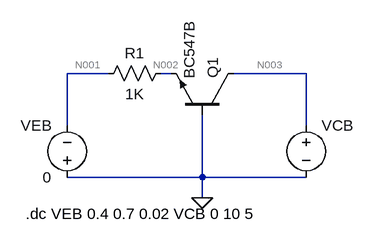
[diagram p0: schematic Draft2.asc]
Draft2.asc, the LTspice schematic file:
Version 4.1
SHEET 1 880 680
WIRE 16 80 -48 80
WIRE 112 80 96 80
WIRE 320 80 208 80
WIRE -48 160 -48 80
WIRE 320 160 320 80
WIRE 160 240 160 144
WIRE 160 240 -48 240
WIRE 320 240 160 240
WIRE 160 272 160 240
FLAG 160 272 0
SYMBOL npn 208 144 M270
SYMATTR InstName Q1
SYMATTR Value BC547B
SYMBOL res 112 64 R90
WINDOW 0 0 56 VBottom 2
WINDOW 3 32 56 VTop 2
SYMATTR InstName R1
SYMATTR Value 1K
SYMBOL voltage 320 144 R0
WINDOW 3 24 44 Left 2
WINDOW 123 0 0 Left 0
WINDOW 39 0 0 Left 0
SYMATTR InstName VCB
SYMATTR Value ""
SYMBOL voltage -48 256 R180
WINDOW 0 24 96 Left 2
WINDOW 3 24 16 Left 2
SYMATTR InstName VEB
SYMATTR Value 0
TEXT -112 296 Left 2 !.dc VEB 0.4 0.7 0.02 VCB 0 10 5

The netlist it stands for:
* Draft2.asc
Q1 N003 0 N002 0 BC547B
R1 N002 N001 1K
VCB N003 0
VEB 0 N001 0
.model NPN NPN
.model PNP PNP
.lib standard.bjt
.dc VEB 0.4 0.7 0.02 VCB 0 10 5
.backanno
.end

* Results of the author's LTspice run, read from the files saved beside the schematic
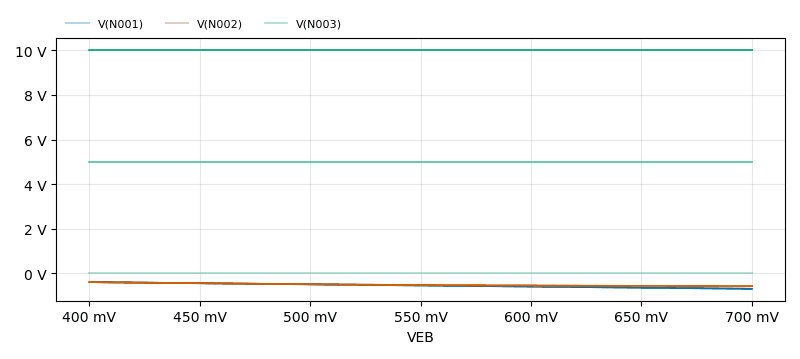
[diagram p1: DC transfer characteristic of Draft2.asc, plotted from the saved traces]
* DC transfer characteristic, 3 runs:
*   V(N001) [VCB=0]: -400 mV at VEB=400 mV, -700 mV at VEB=700 mV, min -700 mV, max -400 mV
*   V(N001) [VCB=5]: -400 mV at VEB=400 mV, -700 mV at VEB=700 mV, min -700 mV, max -400 mV
*   V(N001) [VCB=10]: -400 mV at VEB=400 mV, -700 mV at VEB=700 mV, min -700 mV, max -400 mV
*   V(N002) [VCB=0]: -399.9 mV at VEB=400 mV, -582.4 mV at VEB=700 mV, min -582.4 mV, max -399.9 mV
*   V(N002) [VCB=5]: -399.9 mV at VEB=400 mV, -580.8 mV at VEB=700 mV, min -580.8 mV, max -399.9 mV
*   V(N002) [VCB=10]: -399.9 mV at VEB=400 mV, -579.2 mV at VEB=700 mV, min -579.2 mV, max -399.9 mV
*   V(N003) [VCB=0]: 0 V at VEB=400 mV, 0 V at VEB=700 mV, min 0 V, max 0 V
*   V(N003) [VCB=5]: 5 V at VEB=400 mV, 5 V at VEB=700 mV, min 5 V, max 5 V
*   V(N003) [VCB=10]: 10 V at VEB=400 mV, 10 V at VEB=700 mV, min 10 V, max 10 V